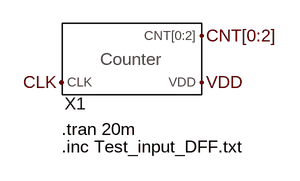
[diagram p0: schematic Test_Counter.asc]
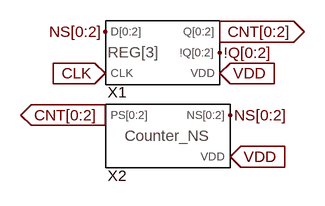
[diagram p1: sub-circuit counter.asc]
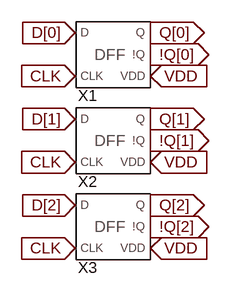
[diagram p2: sub-circuit reg[3].asc]
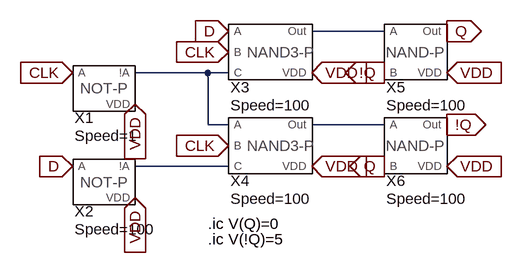
[diagram p3: sub-circuit dff.asc]
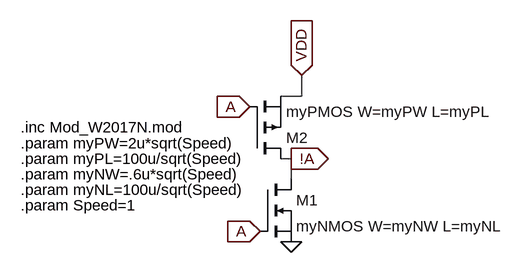
[diagram p4: sub-circuit gate_not_param.asc]
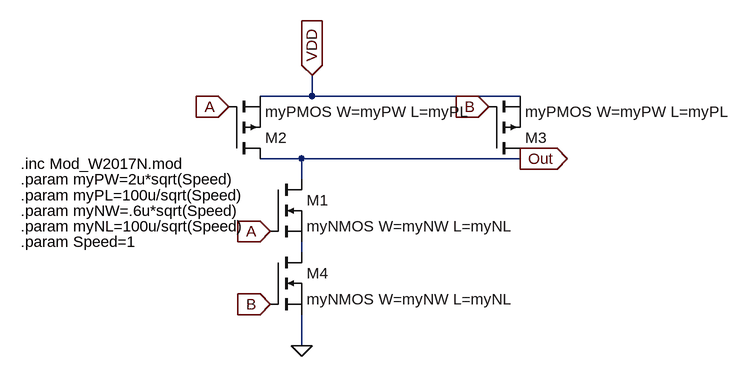
[diagram p5: sub-circuit gate_nand_param.asc]
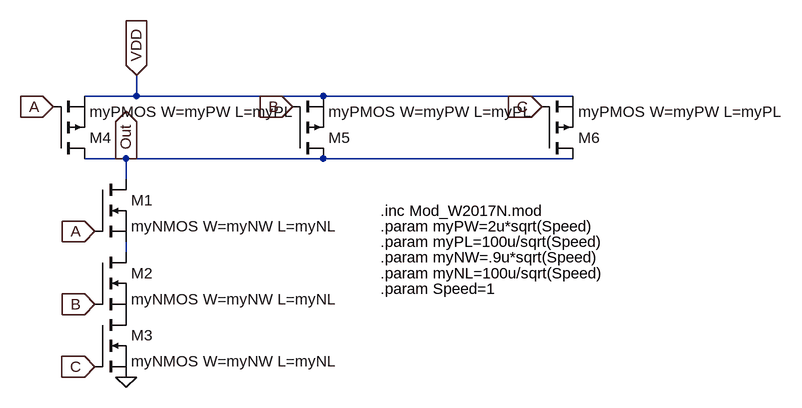
[diagram p6: sub-circuit gate_nand3_param.asc]
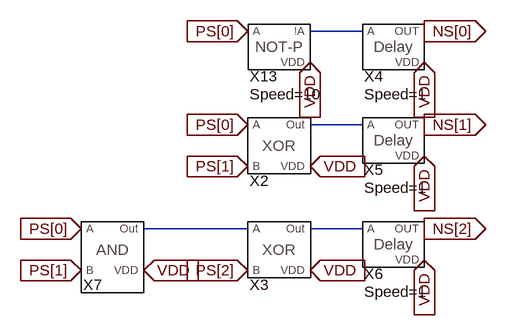
[diagram p7: sub-circuit counter_ns.asc]
Test_Counter.asc, the LTspice schematic file:
Version 4
SHEET 1 880 680
FLAG -32 176 CLK
FLAG 160 176 VDD
FLAG 160 112 CNT[0:2]
SYMBOL Counter 64 144 R0
SYMATTR InstName X1
TEXT -32 240 Left 2 !.tran 20m
TEXT -32 264 Left 2 !.inc Test_input_DFF.txt

counter.asc, the sub-circuit schematic file:
Version 4
SHEET 1 880 680
FLAG 368 112 VDD
IOPIN 368 112 In
FLAG 368 48 CNT[0:2]
IOPIN 368 48 Out
FLAG 384 176 NS[0:2]
FLAG 192 48 NS[0:2]
FLAG 384 240 VDD
IOPIN 384 240 In
FLAG 192 112 CLK
IOPIN 192 112 In
FLAG 192 176 CNT[0:2]
IOPIN 192 176 Out
FLAG 368 80 !Q[0:2]
SYMBOL REG[3] 240 80 R0
SYMATTR InstName X1
SYMBOL Counter_NS 288 208 R0
SYMATTR InstName X2

reg[3].asc, the sub-circuit schematic file:
Version 4
SHEET 1 880 680
FLAG 368 112 VDD
IOPIN 368 112 In
FLAG 368 -16 VDD
IOPIN 368 -16 In
FLAG 368 240 VDD
IOPIN 368 240 In
FLAG 368 -80 Q[0]
IOPIN 368 -80 Out
FLAG 368 -48 !Q[0]
IOPIN 368 -48 Out
FLAG 368 48 Q[1]
IOPIN 368 48 Out
FLAG 368 80 !Q[1]
IOPIN 368 80 Out
FLAG 368 176 Q[2]
IOPIN 368 176 Out
FLAG 368 208 !Q[2]
IOPIN 368 208 Out
FLAG 256 176 D[2]
IOPIN 256 176 In
FLAG 256 240 CLK
IOPIN 256 240 In
FLAG 256 48 D[1]
IOPIN 256 48 In
FLAG 256 -80 D[0]
IOPIN 256 -80 In
FLAG 256 112 CLK
IOPIN 256 112 In
FLAG 256 -16 CLK
IOPIN 256 -16 In
SYMBOL DFF 304 80 R0
SYMATTR InstName X2
SYMBOL DFF 304 -48 R0
SYMATTR InstName X1
SYMBOL DFF 304 208 R0
SYMATTR InstName X3

dff.asc, the sub-circuit schematic file:
Version 4
SHEET 1 880 680
WIRE 272 -64 160 -64
WIRE 0 0 -112 0
WIRE 32 0 0 0
WIRE 0 80 0 0
WIRE 32 80 0 80
WIRE 272 80 160 80
WIRE 32 144 -112 144
FLAG -208 144 D
IOPIN -208 144 In
FLAG -208 0 CLK
IOPIN -208 0 In
FLAG -112 48 VDD
IOPIN -112 48 In
FLAG 32 -64 D
IOPIN 32 -64 In
FLAG 32 112 CLK
IOPIN 32 112 In
FLAG 32 -32 CLK
IOPIN 32 -32 In
FLAG 160 144 VDD
IOPIN 160 144 In
FLAG 160 0 VDD
IOPIN 160 0 In
FLAG 368 0 VDD
IOPIN 368 0 In
FLAG 368 144 VDD
IOPIN 368 144 In
FLAG 368 -64 Q
IOPIN 368 -64 Out
FLAG 368 80 !Q
IOPIN 368 80 Out
FLAG 272 0 !Q
IOPIN 272 0 Out
FLAG 272 144 Q
IOPIN 272 144 Out
FLAG -112 192 VDD
IOPIN -112 192 In
SYMBOL Gate_NOT_PARAM -160 32 R0
WINDOW 39 -45 65 Left 2
SYMATTR SpiceLine Speed=1
SYMATTR InstName X1
SYMBOL Gate_NOT_PARAM -160 176 R0
WINDOW 39 -45 65 Left 2
SYMATTR SpiceLine Speed=100
SYMATTR InstName X2
SYMBOL Gate_NAND_PARAM 320 112 R0
WINDOW 39 -45 82 Left 2
SYMATTR SpiceLine Speed=100
SYMATTR InstName X6
SYMBOL Gate_NAND_PARAM 320 -32 R0
WINDOW 39 -45 82 Left 2
SYMATTR SpiceLine Speed=100
SYMATTR InstName X5
SYMBOL Gate_NAND3_PARAM 96 -32 R0
WINDOW 39 -61 82 Left 2
SYMATTR SpiceLine Speed=100
SYMATTR InstName X3
SYMBOL Gate_NAND3_PARAM 96 112 R0
WINDOW 39 -61 82 Left 2
SYMATTR SpiceLine Speed=100
SYMATTR InstName X4
TEXT 0 232 Left 2 !.ic V(Q)=0
TEXT 0 256 Left 2 !.ic V(!Q)=5

gate_not_param.asc, the sub-circuit schematic file:
Version 4
SHEET 1 880 680
WIRE 64 -112 64 -144
WIRE 64 -112 32 -112
WIRE 48 -16 32 -16
WIRE 48 16 48 -16
FLAG 48 -16 !A
IOPIN 48 -16 Out
FLAG 64 -144 VDD
IOPIN 64 -144 In
FLAG 48 112 0
FLAG 0 96 A
IOPIN 0 96 In
FLAG -16 -96 A
IOPIN -16 -96 In
SYMBOL nmos 0 16 R0
SYMATTR InstName M1
SYMATTR Value myNMOS W=myNW L=myNL
SYMBOL pmos -16 -16 M180
SYMATTR InstName M2
SYMATTR Value myPMOS W=myPW L=myPL
TEXT -368 -64 Left 2 !.inc Mod_W2017N.mod
TEXT -368 -40 Left 2 !.param myPW=2u*sqrt(Speed)
TEXT -368 -16 Left 2 !.param myPL=100u/sqrt(Speed)
TEXT -368 8 Left 2 !.param myNW=.6u*sqrt(Speed)
TEXT -368 32 Left 2 !.param myNL=100u/sqrt(Speed)
TEXT -368 56 Left 2 !.param Speed=1

gate_nand_param.asc, the sub-circuit schematic file:
Version 4
SHEET 1 880 680
WIRE 64 -112 64 -144
WIRE 64 -112 -16 -112
WIRE 384 -112 64 -112
WIRE 48 -16 -16 -16
WIRE 384 -16 48 -16
WIRE 48 16 48 -16
WIRE 48 128 48 112
WIRE 48 272 48 224
FLAG 48 272 0
FLAG 64 -144 VDD
IOPIN 64 -144 In
FLAG 0 208 B
IOPIN 0 208 In
FLAG 0 96 A
IOPIN 0 96 In
FLAG -64 -96 A
IOPIN -64 -96 In
FLAG 336 -96 B
IOPIN 336 -96 In
FLAG 384 -16 Out
IOPIN 384 -16 Out
SYMBOL nmos 0 16 R0
SYMATTR InstName M1
SYMATTR Value myNMOS W=myNW L=myNL
SYMBOL pmos -64 -16 M180
SYMATTR InstName M2
SYMATTR Value myPMOS W=myPW L=myPL
SYMBOL pmos 336 -16 M180
SYMATTR InstName M3
SYMATTR Value myPMOS W=myPW L=myPL
SYMBOL nmos 0 128 R0
SYMATTR InstName M4
SYMATTR Value myNMOS W=myNW L=myNL
TEXT -384 -8 Left 2 !.inc Mod_W2017N.mod
TEXT -384 16 Left 2 !.param myPW=2u*sqrt(Speed)
TEXT -384 40 Left 2 !.param myPL=100u/sqrt(Speed)
TEXT -384 64 Left 2 !.param myNW=.6u*sqrt(Speed)
TEXT -384 88 Left 2 !.param myNL=100u/sqrt(Speed)
TEXT -384 112 Left 2 !.param Speed=1

gate_nand3_param.asc, the sub-circuit schematic file:
Version 4
SHEET 1 1256 680
WIRE 64 -112 64 -144
WIRE 64 -112 -16 -112
WIRE 352 -112 64 -112
WIRE 736 -112 352 -112
WIRE 48 -16 -16 -16
WIRE 352 -16 48 -16
WIRE 736 -16 352 -16
WIRE 48 16 48 -16
WIRE 48 128 48 112
FLAG 48 320 0
FLAG 0 208 B
IOPIN 0 208 In
FLAG 48 -16 Out
IOPIN 48 -16 Out
FLAG 64 -144 VDD
IOPIN 64 -144 In
FLAG 304 -96 B
IOPIN 304 -96 In
FLAG -64 -96 A
IOPIN -64 -96 In
FLAG 0 96 A
IOPIN 0 96 In
FLAG 0 304 C
IOPIN 0 304 In
FLAG 688 -96 C
IOPIN 688 -96 In
SYMBOL nmos 0 16 R0
SYMATTR InstName M1
SYMATTR Value myNMOS W=myNW L=myNL
SYMBOL pmos -64 -16 M180
SYMATTR InstName M4
SYMATTR Value myPMOS W=myPW L=myPL
SYMBOL pmos 304 -16 M180
SYMATTR InstName M5
SYMATTR Value myPMOS W=myPW L=myPL
SYMBOL nmos 0 128 R0
SYMATTR InstName M2
SYMATTR Value myNMOS W=myNW L=myNL
SYMBOL nmos 0 224 R0
SYMATTR InstName M3
SYMATTR Value myNMOS W=myNW L=myNL
SYMBOL pmos 688 -16 M180
SYMATTR InstName M6
SYMATTR Value myPMOS W=myPW L=myPL
TEXT 440 64 Left 2 !.inc Mod_W2017N.mod
TEXT 440 88 Left 2 !.param myPW=2u*sqrt(Speed)
TEXT 440 112 Left 2 !.param myPL=100u/sqrt(Speed)
TEXT 440 136 Left 2 !.param myNW=.9u*sqrt(Speed)
TEXT 440 160 Left 2 !.param myNL=100u/sqrt(Speed)
TEXT 440 184 Left 2 !.param Speed=1

counter_ns.asc, the sub-circuit schematic file:
Version 4
SHEET 1 904 680
WIRE 160 -880 80 -880
WIRE 160 -736 80 -736
WIRE -16 -576 -176 -576
WIRE 160 -576 80 -576
FLAG 80 -832 VDD
IOPIN 80 -832 In
FLAG -16 -880 PS[0]
IOPIN -16 -880 In
FLAG -16 -736 PS[0]
IOPIN -16 -736 In
FLAG -16 -672 PS[1]
IOPIN -16 -672 In
FLAG 256 -736 NS[1]
IOPIN 256 -736 Out
FLAG 80 -672 VDD
IOPIN 80 -672 In
FLAG -272 -576 PS[0]
IOPIN -272 -576 In
FLAG -16 -512 PS[2]
IOPIN -16 -512 In
FLAG 256 -576 NS[2]
IOPIN 256 -576 Out
FLAG 80 -512 VDD
IOPIN 80 -512 In
FLAG 256 -832 VDD
IOPIN 256 -832 In
FLAG 256 -688 VDD
IOPIN 256 -688 In
FLAG 256 -528 VDD
IOPIN 256 -528 In
FLAG -272 -512 PS[1]
IOPIN -272 -512 In
FLAG -176 -512 VDD
IOPIN -176 -512 In
FLAG 256 -880 NS[0]
IOPIN 256 -880 Out
SYMBOL Gate_Delay 208 -848 R0
WINDOW 39 -45 65 Left 2
SYMATTR SpiceLine Speed=1
SYMATTR InstName X4
SYMBOL Gate_Delay 208 -704 R0
WINDOW 39 -45 65 Left 2
SYMATTR SpiceLine Speed=1
SYMATTR InstName X5
SYMBOL Gate_Delay 208 -544 R0
WINDOW 39 -45 65 Left 2
SYMATTR SpiceLine Speed=1
SYMATTR InstName X6
SYMBOL Gate_XOR 32 -704 R0
SYMATTR InstName X2
SYMBOL Gate_XOR 32 -544 R0
SYMATTR InstName X3
SYMBOL Gate_AND -224 -544 R0
SYMATTR InstName X7
SYMBOL Gate_NOT_PARAM 32 -848 R0
WINDOW 39 -45 65 Left 2
SYMATTR InstName X13
SYMATTR SpiceLine Speed=10

gate_delay.asc, the sub-circuit schematic file:
Version 4
SHEET 1 880 680
WIRE -384 -80 -384 -112
WIRE -384 -80 -400 -80
WIRE -16 -80 -16 -112
WIRE -16 -80 -32 -80
WIRE -80 -64 -112 -64
WIRE -112 16 -112 -64
WIRE -112 16 -400 16
WIRE 0 16 -32 16
WIRE -112 96 -112 16
WIRE -80 96 -112 96
FLAG -384 -112 VDD
IOPIN -384 -112 In
FLAG -400 112 0
FLAG -448 -64 A
IOPIN -448 -64 In
FLAG -448 96 A
IOPIN -448 96 In
FLAG -16 -112 VDD
IOPIN -16 -112 In
FLAG -32 112 0
FLAG 0 16 Out
IOPIN 0 16 Out
SYMBOL nmos -448 16 R0
SYMATTR InstName M1
SYMATTR Value myNMOS w=myNW L=myNL
SYMBOL pmos -448 16 M180
SYMATTR InstName M2
SYMATTR Value myPMOS W=myPW L=myPL
SYMBOL nmos -80 16 R0
SYMATTR InstName M3
SYMATTR Value myNMOS w=myNW L=myNL
SYMBOL pmos -80 16 M180
SYMATTR InstName M4
SYMATTR Value myPMOS W=myPW L=myPL
TEXT -344 136 Left 2 !.inc Mod_W2017N.mod
TEXT -344 160 Left 2 !.param myPW=2u*sqrt(Speed)
TEXT -344 184 Left 2 !.param myPL=100u/sqrt(Speed)
TEXT -344 208 Left 2 !.param myNW=.1u*sqrt(Speed)
TEXT -344 232 Left 2 !.param myNL=500u/sqrt(Speed)
TEXT -344 256 Left 2 !.param Speed=.1

gate_xor.asc, the sub-circuit schematic file:
Version 4
SHEET 1 880 680
WIRE 256 -208 -16 -208
WIRE 336 -96 304 -96
WIRE 224 -16 -16 -16
WIRE 256 -16 224 -16
WIRE 224 0 224 -16
WIRE 272 0 224 0
WIRE 272 16 224 0
WIRE 272 16 48 16
WIRE -48 96 -192 96
WIRE 352 96 320 96
WIRE 272 112 48 112
WIRE -64 192 -64 -96
WIRE -64 192 -144 192
WIRE -48 192 -48 96
WIRE 0 192 -48 192
WIRE 448 192 320 192
WIRE 272 208 48 208
WIRE 48 272 48 208
WIRE -48 304 -48 192
WIRE 336 304 336 -96
WIRE 336 304 -48 304
WIRE -64 320 -64 192
WIRE 352 320 352 96
WIRE 352 320 -64 320
FLAG 48 272 0
FLAG 256 -208 VDD
IOPIN 256 -208 In
FLAG -240 192 B
IOPIN -240 192 In
FLAG -288 96 A
IOPIN -288 96 In
FLAG 304 -192 B
IOPIN 304 -192 In
FLAG 0 96 A
IOPIN 0 96 In
FLAG 448 192 B
IOPIN 448 192 In
FLAG -64 -192 A
IOPIN -64 -192 In
FLAG 272 0 Out
IOPIN 272 0 Out
FLAG -192 144 VDD
IOPIN -192 144 In
FLAG -144 240 VDD
IOPIN -144 240 In
SYMBOL nmos 0 16 R0
SYMATTR InstName M1
SYMATTR Value RIT4007N7
SYMBOL pmos -64 -16 M180
SYMATTR InstName M2
SYMATTR Value RIT4007P7
SYMBOL pmos 304 -16 R180
SYMATTR InstName M3
SYMATTR Value RIT4007P7
SYMBOL nmos 0 112 R0
SYMATTR InstName M4
SYMATTR Value RIT4007N7
SYMBOL nmos 320 112 M0
SYMATTR InstName M5
SYMATTR Value RIT4007N7
SYMBOL nmos 320 16 M0
SYMATTR InstName M6
SYMATTR Value RIT4007N7
SYMBOL pmos 304 -112 R180
SYMATTR InstName M7
SYMATTR Value RIT4007P7
SYMBOL pmos -64 -112 M180
SYMATTR InstName M8
SYMATTR Value RIT4007P7
SYMBOL Gate_NOT -240 128 R0
SYMATTR InstName X1
SYMBOL Gate_NOT -192 224 R0
SYMATTR InstName X4
TEXT -360 368 Left 2 !.inc CD4007.mod

gate_not.asc, the sub-circuit schematic file:
Version 4
SHEET 1 880 680
WIRE 64 -112 64 -144
WIRE 64 -112 -16 -112
WIRE -64 -96 -112 -96
WIRE 48 -16 -16 -16
WIRE 48 16 48 -16
WIRE -112 80 -112 -96
WIRE -112 96 -112 80
WIRE 0 96 -112 96
WIRE 48 272 48 112
FLAG 48 272 0
FLAG -112 80 A
IOPIN -112 80 In
FLAG 48 -16 !A
IOPIN 48 -16 Out
FLAG 64 -144 VDD
IOPIN 64 -144 In
SYMBOL nmos 0 16 R0
SYMATTR InstName M1
SYMATTR Value RIT4007N7
SYMBOL pmos -64 -16 M180
SYMATTR InstName M2
SYMATTR Value RIT4007P7
TEXT -360 368 Left 2 !.inc CD4007.mod

gate_and.asc, the sub-circuit schematic file:
Version 4
SHEET 1 880 680
WIRE -144 0 -224 0
FLAG -224 64 VDD
IOPIN -224 64 In
FLAG -48 48 VDD
IOPIN -48 48 In
FLAG -320 64 B
IOPIN -320 64 In
FLAG -320 0 A
IOPIN -320 0 In
FLAG -48 0 Out
IOPIN -48 0 Out
SYMBOL Gate_NAND -272 32 R0
SYMATTR InstName X3
SYMBOL Gate_NOT -96 32 R0
SYMATTR InstName X4

The netlist it stands for:
* Test_Counter.asc
XX1 VDD CNT[0] CNT[1] CNT[2] CLK counter

* block symbol definitions
.subckt counter VDD CNT[0] CNT[1] CNT[2] CLK
XX1 NS[0] NS[1] NS[2] VDD CNT[0] CNT[1] CNT[2] CLK !Q[0] !Q[1] !Q[2] reg[3]
XX2 CNT[0] CNT[1] CNT[2] VDD NS[0] NS[1] NS[2] counter_ns
.ends counter

.subckt reg[3] D[0] D[1] D[2] VDD Q[0] Q[1] Q[2] CLK !Q[0] !Q[1] !Q[2]
XX2 D[1] VDD Q[1] CLK !Q[1] dff
XX1 D[0] VDD Q[0] CLK !Q[0] dff
XX3 D[2] VDD Q[2] CLK !Q[2] dff
.ends reg[3]

.subckt dff D VDD Q CLK !Q
XX1 CLK VDD N002 gate_not_param params: Speed=1
XX2 D VDD N004 gate_not_param params: Speed=100
XX6 N003 Q !Q VDD gate_nand_param params: Speed=100
XX5 N001 !Q Q VDD gate_nand_param params: Speed=100
XX3 D CLK N002 VDD N001 gate_nand3_param params: Speed=100
XX4 N002 CLK N004 VDD N003 gate_nand3_param params: Speed=100
.ic V(Q)=0
.ic V(!Q)=5
.ends dff

.subckt gate_not_param A VDD !A
M1 !A A 0 0 myNMOS W=myNW L=myNL
M2 !A A VDD VDD myPMOS W=myPW L=myPL
.inc Mod_W2017N.mod
.param myPW=2u*sqrt(Speed)
.param myPL=100u/sqrt(Speed)
.param myNW=.6u*sqrt(Speed)
.param myNL=100u/sqrt(Speed)
.param Speed=1
.ends gate_not_param

.subckt gate_nand_param A B Out VDD
M1 Out A N001 N001 myNMOS W=myNW L=myNL
M2 Out A VDD VDD myPMOS W=myPW L=myPL
M3 Out B VDD VDD myPMOS W=myPW L=myPL
M4 N001 B 0 0 myNMOS W=myNW L=myNL
.inc Mod_W2017N.mod
.param myPW=2u*sqrt(Speed)
.param myPL=100u/sqrt(Speed)
.param myNW=.6u*sqrt(Speed)
.param myNL=100u/sqrt(Speed)
.param Speed=1
.ends gate_nand_param

.subckt gate_nand3_param A B C VDD Out
M1 Out A N001 N001 myNMOS W=myNW L=myNL
M4 Out A VDD VDD myPMOS W=myPW L=myPL
M5 Out B VDD VDD myPMOS W=myPW L=myPL
M2 N001 B P001 P001 myNMOS W=myNW L=myNL
M3 P001 C 0 0 myNMOS W=myNW L=myNL
M6 Out C VDD VDD myPMOS W=myPW L=myPL
.inc Mod_W2017N.mod
.param myPW=2u*sqrt(Speed)
.param myPL=100u/sqrt(Speed)
.param myNW=.9u*sqrt(Speed)
.param myNL=100u/sqrt(Speed)
.param Speed=1
.ends gate_nand3_param

.subckt counter_ns PS[0] PS[1] PS[2] VDD NS[0] NS[1] NS[2]
XX4 N001 VDD NS[0] gate_delay params: Speed=1
XX5 N002 VDD NS[1] gate_delay params: Speed=1
XX6 N004 VDD NS[2] gate_delay params: Speed=1
XX2 PS[0] PS[1] N002 VDD gate_xor
XX3 N003 PS[2] N004 VDD gate_xor
XX7 PS[0] PS[1] N003 VDD gate_and
XX13 PS[0] VDD N001 gate_not_param params: Speed=10
.ends counter_ns

.subckt gate_delay A VDD OUT
M1 N001 A 0 0 myNMOS w=myNW L=myNL
M2 N001 A VDD VDD myPMOS W=myPW L=myPL
M3 Out N001 0 0 myNMOS w=myNW L=myNL
M4 Out N001 VDD VDD myPMOS W=myPW L=myPL
.inc Mod_W2017N.mod
.param myPW=2u*sqrt(Speed)
.param myPL=100u/sqrt(Speed)
.param myNW=.1u*sqrt(Speed)
.param myNL=500u/sqrt(Speed)
.param Speed=.1
.ends gate_delay

.subckt gate_xor A B Out VDD
M1 Out A N003 N003 RIT4007N7
M2 Out N002 P001 P001 RIT4007P7
M3 Out N001 P002 P002 RIT4007P7
M4 N003 N001 0 0 RIT4007N7
M5 N003 B 0 0 RIT4007N7
M6 Out N002 N003 N003 RIT4007N7
M7 P002 B VDD VDD RIT4007P7
M8 P001 A VDD VDD RIT4007P7
XX1 A VDD N001 gate_not
XX4 B VDD N002 gate_not
.inc CD4007.mod
.ends gate_xor

.subckt gate_not A VDD !A
M1 !A A 0 0 RIT4007N7
M2 !A A VDD VDD RIT4007P7
.inc CD4007.mod
.ends gate_not

.subckt gate_and A B Out VDD
XX3 A B N001 VDD Gate_NAND  ; pins A B Out VDD
XX4 N001 VDD Out gate_not
.ends gate_and

.model NMOS NMOS
.model PMOS PMOS
.lib standard.mos
.tran 20m
.inc Test_input_DFF.txt
.backanno
.end